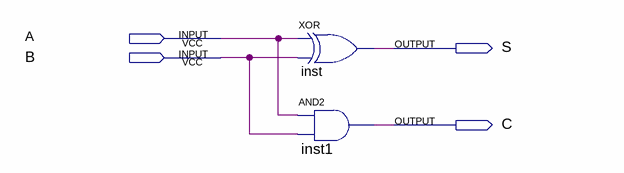
[diagram p0: schematic sheet]
// Quartus schematic Half_adder.bdf as structural Verilog: 2 symbols, 4 pins
module Half_adder (
  input  A,
  input  B,
  output S,
  output C
);

  xor inst (S, A, B);
  and inst1 (C, A, B);
endmodule
